# Altium schematic sheet Sheet6.SchDoc
size A3; PageSetup: Record=PageOptions|CenterHorizontal=True|CenterVertical=True|PrintScale=1.00|XCorrection=1.00|YCorrection=1.00|PrintKind=0|BorderSize=5000000|LeftOffset=0|BottomOffset=0|Orientation=2|PaperLength=1000|PaperWidth=1000|Scale=100|PaperSource=7|PrintQuality=-3|MediaType=1|DitherType=10|PrintScaleMode=1|PaperKind=A3|PaperIndex=8
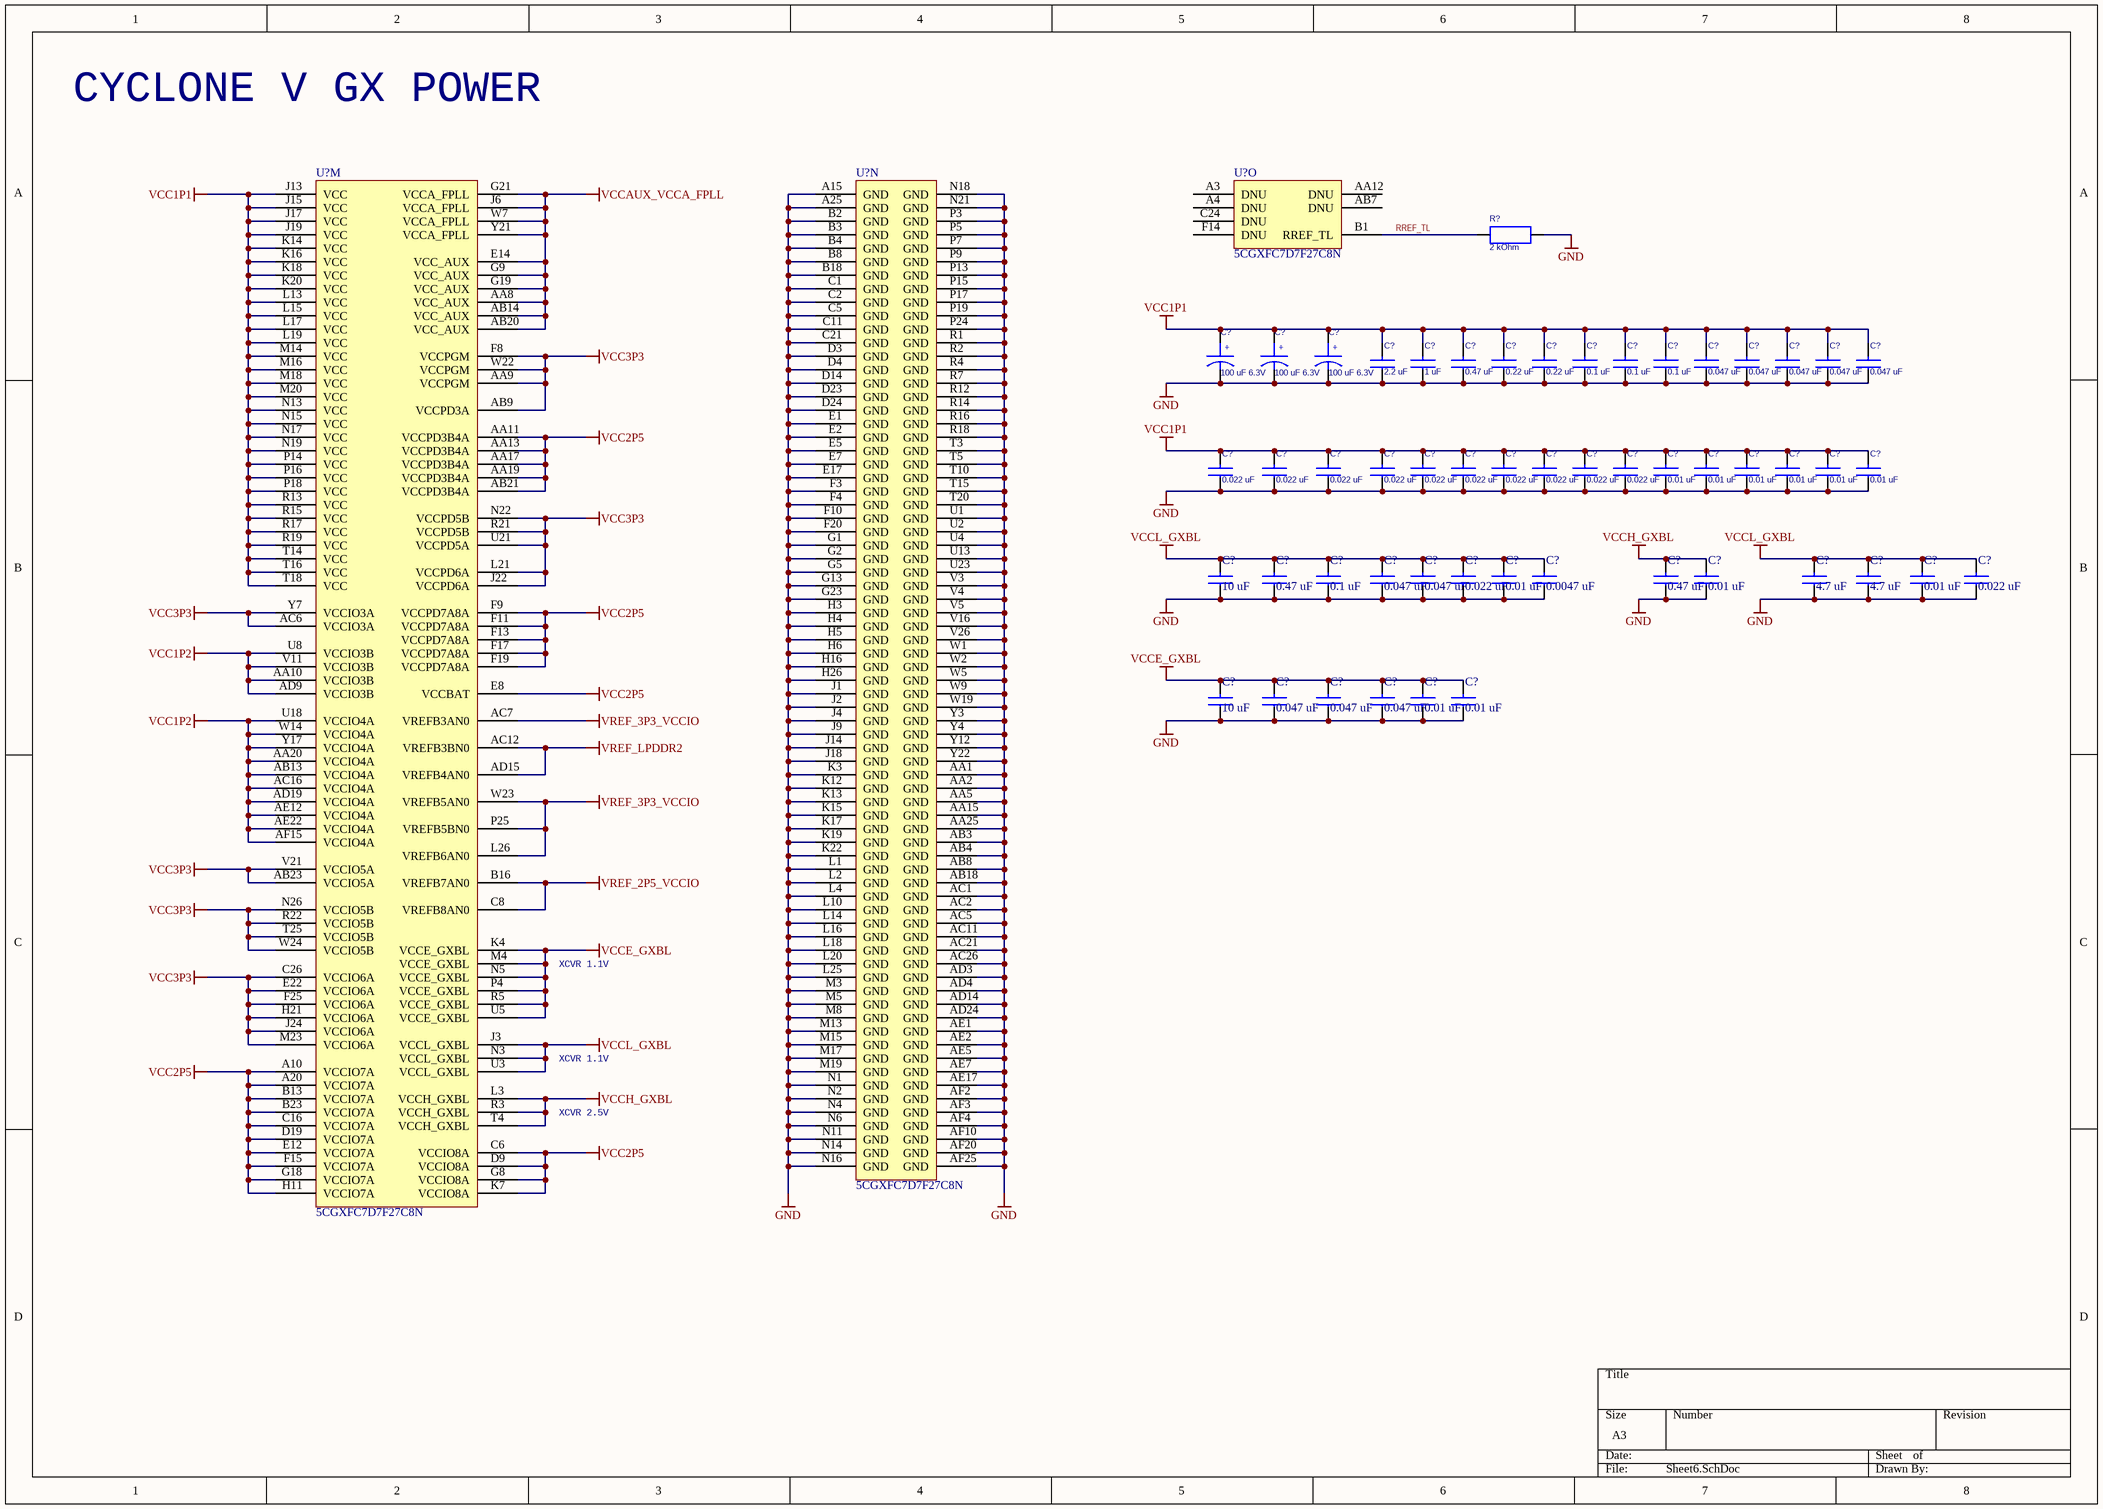
[diagram p0: Sheet6.SchDoc]

## Parts
(Parts that share a designator on the sheet are numbered #1, #2 ... from top to bottom, then left to right.)
C?#1  100 uF 6.3V  [TC3528-1411]
C?#2  100 uF 6.3V  [TC3528-1411]
C?#3  100 uF 6.3V  [TC3528-1411]
C?#4  2.2 uF  [CAPC1608N]
C?#5  1 uF  [CAPC1608N]
C?#6  0.47 uF  [CAPC1608N]
C?#7  0.22 uF  [CAPC1608N]
C?#8  0.22 uF  [CAPC1608N]
C?#9  0.1 uF  [CAPC1608N]
C?#10  0.1 uF  [CAPC1608N]
C?#11  0.1 uF  [CAPC1608N]
C?#12  0.047 uF  [CAPC1608N]
C?#13  0.047 uF  [CAPC1608N]
C?#14  0.047 uF  [CAPC1608N]
C?#15  0.047 uF  [CAPC1608N]
C?#16  0.047 uF  [CAPC1608N]
C?#17  0.022 uF  [CAPC1608N]
C?#18  0.022 uF  [CAPC1608N]
C?#19  0.022 uF  [CAPC1608N]
C?#20  0.022 uF  [CAPC1608N]
C?#21  0.022 uF  [CAPC1608N]
C?#22  0.022 uF  [CAPC1608N]
C?#23  0.022 uF  [CAPC1608N]
C?#24  0.022 uF  [CAPC1608N]
C?#25  0.022 uF  [CAPC1608N]
C?#26  0.022 uF  [CAPC1608N]
C?#27  0.01 uF  [CAPC1608N]
C?#28  0.01 uF  [CAPC1608N]
C?#29  0.01 uF  [CAPC1608N]
C?#30  0.01 uF  [CAPC1608N]
C?#31  0.01 uF  [CAPC1608N]
C?#32  0.01 uF  [CAPC1608N]
C?#33  10 uF  [CAPC1608N]
C?#34  0.47 uF  [CAPC1608N]
C?#35  0.1 uF  [CAPC1608N]
C?#36  0.047 uF  [CAPC1608N]
C?#37  0.047 uF  [CAPC1608N]
C?#38  0.022 uF  [CAPC1608N]
C?#39  0.01 uF  [CAPC1608N]
C?#40  0.0047 uF  [CAPC1608N]
C?#41  0.47 uF  [CAPC1608N]
C?#42  0.01 uF  [CAPC1608N]
C?#43  4.7 uF  [CAPC1608N]
C?#44  4.7 uF  [CAPC1608N]
C?#45  0.01 uF  [CAPC1608N]
C?#46  0.022 uF  [CAPC1608N]
C?#47  10 uF  [CAPC1608N]
C?#48  0.047 uF  [CAPC1608N]
C?#49  0.047 uF  [CAPC1608N]
C?#50  0.047 uF  [CAPC1608N]
C?#51  0.01 uF  [CAPC1608N]
C?#52  0.01 uF  [CAPC1608N]
R?  2 kOhm  [RESC1608N]
U?#1  5CGXFC7D7F27C8N  [ALTR-672-FBGA-2000A]  (part M of 15)
U?#2  5CGXFC7D7F27C8N  [ALTR-672-FBGA-2000A]  (part N of 15)
U?#3  5CGXFC7D7F27C8N  [ALTR-672-FBGA-2000A]  (part O of 15)

## Nets
GND: C?#1.2(Negative) C?#2.2(Negative) C?#3.2(Negative) C?#4.1 C?#5.1 C?#6.1 C?#7.1 C?#8.1 C?#9.1 C?#10.1 C?#11.1 C?#12.1 C?#13.1 C?#14.1 C?#15.1 C?#16.1 C?#17.1 C?#18.1 C?#19.1 C?#20.1 C?#21.1 C?#22.1 C?#23.1 C?#24.1 C?#25.1 C?#26.1 C?#27.1 C?#28.1 C?#29.1 C?#30.1 C?#31.1 C?#32.1 C?#33.1 C?#34.1 C?#35.1 C?#36.1 C?#37.1 C?#38.1 C?#39.1 C?#40.1 C?#41.1 C?#42.1 C?#43.1 C?#44.1 C?#45.1 C?#46.1 C?#47.1 C?#48.1 C?#49.1 C?#50.1 C?#51.1 C?#52.1 R?.2 U?#2.A15(GND) U?#2.A25(GND) U?#2.AA1(GND) U?#2.AA2(GND) U?#2.AA5(GND) U?#2.AA15(GND) U?#2.AA25(GND) U?#2.AB3(GND) U?#2.AB4(GND) U?#2.AB8(GND) U?#2.AB18(GND) U?#2.AC1(GND) U?#2.AC2(GND) U?#2.AC5(GND) U?#2.AC11(GND) U?#2.AC21(GND) U?#2.AC26(GND) U?#2.AD3(GND) U?#2.AD4(GND) U?#2.AD14(GND) U?#2.AD24(GND) U?#2.AE1(GND) U?#2.AE2(GND) U?#2.AE5(GND) U?#2.AE7(GND) U?#2.AE17(GND) U?#2.AF2(GND) U?#2.AF3(GND) U?#2.AF4(GND) U?#2.AF10(GND) U?#2.AF20(GND) U?#2.AF25(GND) U?#2.B2(GND) U?#2.B3(GND) U?#2.B4(GND) U?#2.B8(GND) U?#2.B18(GND) U?#2.C1(GND) U?#2.C2(GND) U?#2.C5(GND) U?#2.C11(GND) U?#2.C21(GND) U?#2.D3(GND) U?#2.D4(GND) U?#2.D14(GND) U?#2.D23(GND) U?#2.D24(GND) U?#2.E1(GND) U?#2.E2(GND) U?#2.E5(GND) U?#2.E7(GND) U?#2.E17(GND) U?#2.F3(GND) U?#2.F4(GND) U?#2.F10(GND) U?#2.F20(GND) U?#2.G1(GND) U?#2.G2(GND) U?#2.G5(GND) U?#2.G13(GND) U?#2.G23(GND) U?#2.H3(GND) U?#2.H4(GND) U?#2.H5(GND) U?#2.H6(GND) U?#2.H16(GND) U?#2.H26(GND) U?#2.J1(GND) U?#2.J2(GND) U?#2.J4(GND) U?#2.J9(GND) U?#2.J14(GND) U?#2.J18(GND) U?#2.K3(GND) U?#2.K12(GND) U?#2.K13(GND) U?#2.K15(GND) U?#2.K17(GND) U?#2.K19(GND) U?#2.K22(GND) U?#2.L1(GND) U?#2.L2(GND) U?#2.L4(GND) U?#2.L10(GND) U?#2.L14(GND) U?#2.L16(GND) U?#2.L18(GND) U?#2.L20(GND) U?#2.L25(GND) U?#2.M3(GND) U?#2.M5(GND) U?#2.M8(GND) U?#2.M13(GND) U?#2.M15(GND) U?#2.M17(GND) U?#2.M19(GND) U?#2.N1(GND) U?#2.N2(GND) U?#2.N4(GND) U?#2.N6(GND) U?#2.N11(GND) U?#2.N14(GND) U?#2.N16(GND) U?#2.N18(GND) U?#2.N21(GND) U?#2.P3(GND) U?#2.P5(GND) U?#2.P7(GND) U?#2.P9(GND) U?#2.P13(GND) U?#2.P15(GND) U?#2.P17(GND) U?#2.P19(GND) U?#2.P24(GND) U?#2.R1(GND) U?#2.R2(GND) U?#2.R4(GND) U?#2.R7(GND) U?#2.R12(GND) U?#2.R14(GND) U?#2.R16(GND) U?#2.R18(GND) U?#2.T3(GND) U?#2.T5(GND) U?#2.T10(GND) U?#2.T15(GND) U?#2.T20(GND) U?#2.U1(GND) U?#2.U2(GND) U?#2.U4(GND) U?#2.U13(GND) U?#2.U23(GND) U?#2.V3(GND) U?#2.V4(GND) U?#2.V5(GND) U?#2.V16(GND) U?#2.V26(GND) U?#2.W1(GND) U?#2.W2(GND) U?#2.W5(GND) U?#2.W9(GND) U?#2.W19(GND) U?#2.Y3(GND) U?#2.Y4(GND) U?#2.Y12(GND) U?#2.Y22(GND)
VCC1P1: C?#1.1(Positive) C?#2.1(Positive) C?#3.1(Positive) C?#4.2 C?#5.2 C?#6.2 C?#7.2 C?#8.2 C?#9.2 C?#10.2 C?#11.2 C?#12.2 C?#13.2 C?#14.2 C?#15.2 C?#16.2 C?#17.2 C?#18.2 C?#19.2 C?#20.2 C?#21.2 C?#22.2 C?#23.2 C?#24.2 C?#25.2 C?#26.2 C?#27.2 C?#28.2 C?#29.2 C?#30.2 C?#31.2 C?#32.2 U?#1.J13(VCC) U?#1.J15(VCC) U?#1.J17(VCC) U?#1.J19(VCC) U?#1.K14(VCC) U?#1.K16(VCC) U?#1.K18(VCC) U?#1.K20(VCC) U?#1.L13(VCC) U?#1.L15(VCC) U?#1.L17(VCC) U?#1.L19(VCC) U?#1.M14(VCC) U?#1.M16(VCC) U?#1.M18(VCC) U?#1.M20(VCC) U?#1.N13(VCC) U?#1.N15(VCC) U?#1.N17(VCC) U?#1.N19(VCC) U?#1.P14(VCC) U?#1.P16(VCC) U?#1.P18(VCC) U?#1.R13(VCC) U?#1.R15(VCC) U?#1.R17(VCC) U?#1.R19(VCC) U?#1.T14(VCC) U?#1.T16(VCC) U?#1.T18(VCC)
VCC1P2: U?#1.AA10(VCCIO3B) U?#1.AA20(VCCIO4A) U?#1.AB13(VCCIO4A) U?#1.AC16(VCCIO4A) U?#1.AD9(VCCIO3B) U?#1.AD19(VCCIO4A) U?#1.AE12(VCCIO4A) U?#1.AE22(VCCIO4A) U?#1.AF15(VCCIO4A) U?#1.U8(VCCIO3B) U?#1.U18(VCCIO4A) U?#1.V11(VCCIO3B) U?#1.W14(VCCIO4A) U?#1.Y17(VCCIO4A)
VCC2P5: U?#1.A10(VCCIO7A) U?#1.A20(VCCIO7A) U?#1.AA11(VCCPD3B4A) U?#1.AA13(VCCPD3B4A) U?#1.AA17(VCCPD3B4A) U?#1.AA19(VCCPD3B4A) U?#1.AB21(VCCPD3B4A) U?#1.B13(VCCIO7A) U?#1.B23(VCCIO7A) U?#1.C6(VCCIO8A) U?#1.C16(VCCIO7A) U?#1.D9(VCCIO8A) U?#1.D19(VCCIO7A) U?#1.E8(VCCBAT) U?#1.E12(VCCIO7A) U?#1.F9(VCCPD7A8A) U?#1.F11(VCCPD7A8A) U?#1.F13(VCCPD7A8A) U?#1.F15(VCCIO7A) U?#1.F17(VCCPD7A8A) U?#1.F19(VCCPD7A8A) U?#1.G8(VCCIO8A) U?#1.G18(VCCIO7A) U?#1.H11(VCCIO7A) U?#1.K7(VCCIO8A)
VCC3P3: U?#1.AA9(VCCPGM) U?#1.AB9(VCCPD3A) U?#1.AB23(VCCIO5A) U?#1.AC6(VCCIO3A) U?#1.C26(VCCIO6A) U?#1.E22(VCCIO6A) U?#1.F8(VCCPGM) U?#1.F25(VCCIO6A) U?#1.H21(VCCIO6A) U?#1.J22(VCCPD6A) U?#1.J24(VCCIO6A) U?#1.L21(VCCPD6A) U?#1.M23(VCCIO6A) U?#1.N22(VCCPD5B) U?#1.N26(VCCIO5B) U?#1.R21(VCCPD5B) U?#1.R22(VCCIO5B) U?#1.T25(VCCIO5B) U?#1.U21(VCCPD5A) U?#1.V21(VCCIO5A) U?#1.W22(VCCPGM) U?#1.W24(VCCIO5B) U?#1.Y7(VCCIO3A)
VCCAUX_VCCA_FPLL: U?#1.AA8(VCC_AUX) U?#1.AB14(VCC_AUX) U?#1.AB20(VCC_AUX) U?#1.E14(VCC_AUX) U?#1.G9(VCC_AUX) U?#1.G19(VCC_AUX) U?#1.G21(VCCA_FPLL) U?#1.J6(VCCA_FPLL) U?#1.W7(VCCA_FPLL) U?#1.Y21(VCCA_FPLL)
VCCE_GXBL: C?#47.2 C?#48.2 C?#49.2 C?#50.2 C?#51.2 C?#52.2 U?#1.K4(VCCE_GXBL) U?#1.M4(VCCE_GXBL) U?#1.N5(VCCE_GXBL) U?#1.P4(VCCE_GXBL) U?#1.R5(VCCE_GXBL) U?#1.U5(VCCE_GXBL)
VCCH_GXBL: C?#41.2 C?#42.2 U?#1.L3(VCCH_GXBL) U?#1.R3(VCCH_GXBL) U?#1.T4(VCCH_GXBL)
VCCL_GXBL: C?#33.2 C?#34.2 C?#35.2 C?#36.2 C?#37.2 C?#38.2 C?#39.2 C?#40.2 C?#43.2 C?#44.2 C?#45.2 C?#46.2 U?#1.J3(VCCL_GXBL) U?#1.N3(VCCL_GXBL) U?#1.U3(VCCL_GXBL)
VREF_2P5_VCCIO: U?#1.B16(VREFB7AN0) U?#1.C8(VREFB8AN0)
VREF_3P3_VCCIO: U?#1.AC7(VREFB3AN0) U?#1.L26(VREFB6AN0) U?#1.P25(VREFB5BN0) U?#1.W23(VREFB5AN0)
VREF_LPDDR2: U?#1.AC12(VREFB3BN0) U?#1.AD15(VREFB4AN0)
RREF_TL: R?.1 U?#3.B1(RREF_TL)

Not connected (* = marked no-connect by the designer): U?#3 A3(DNU) A4(DNU) AA12(DNU) AB7(DNU) C24(DNU) F14(DNU)

## Notes on the sheet
- CYCLONE V GX POWER
- XCVR 1.1V
- XCVR 2.5V
- (in symbol CAP TANTAL CASE B) +

## Library data of the parts
C?#1-C?#3 = CAP TANTAL CASE B: Vendor Part#: 399-5279-1-ND; Mfg Part#: T491A336K010AT; Vendor: DigiKey; Mfg: Kemet; Oper. Temp. Range: -55C to 125C; RoHS: Yes; Package: 3216-18
C?#4-C?#52 = CC0603: Vendor: DigiKey; Oper. Temp. Range: -55C to 85C; RoHS: Yes; Package: 0603
R? = RC0603: Oper. Temp. Range: -55C to 125C; RoHS: Yes; Package: 0603
U?#1-U?#3 = 5CGXFC7D7F27C8N: Cyclone V GX Family FPGA, 1.07 to 1.13 V Supply, 336 I/O Pins, 7 PLLs, 672-Pin FBGA, Speed Grade 8, Commercial Grade, RoHS Compliant; Manufacturer: Altera; GPIO: 336; Logic Elements (LE) (K): 149.5; Speed Grade: 8; DatasheetVersion: Rev. 3.1; PackageReference: 672-FBGA-2000A; PackageDescription: 672-Pin FineLine Ball-Grid Array (FBGA), Body 27 x 27 mm, Pitch 1 mm; Supplier 1: Digi-Key; Supplier Part Number 1: 544-2773-ND; Supplier 2: Mouser; Supplier Part Number 2: 989-5CGXFC7D7F27C8N; Device Group: 5CGXFC7; RoHS: RoHS Compliant; Subcategory: Cyclone V GX; Voltage Supply: 1.07 to 1.13 V; Mounting Technology: Surface Mount; Code_JEDEC: MS-034-AAL-1; PartNumber: 5CGXFC7D7F27C8N; ComponentLink1Description: Manufacturer URL; ComponentLink1URL: http://www.altera.com; ComponentLink2Description: Datasheet; ComponentLink2URL: http://www.altera.com/literature/hb/cyclone-v/cv_51002.pdf; ComponentLink3Description: Package Specification; ComponentLink3URL: http://www.altera.com/devicepackaging/04R00427-01.pdf; ComponentLink4Description: Device Handbook URL; ComponentLink4URL: http://www.altera.com/literature/hb/cyclone-v/cyclone5_handbook.pdf; ComponentLink5Description: Device Overview URL; ComponentLink5URL: http://www.altera.com/literature/hb/cyclone-v/cv_51001.pdf; ComponentLink6Description: Device Pin-Out URL; ComponentLink6URL: http://www.altera.com/literature/dp/cyclone-v/1.txt; ComponentLink7Description: Product URL; ComponentLink7URL: http://www.buyaltera.com/scripts/partsearch.dll?Detail&name=5CGXFC7D7F27C8N-ND